# Altium schematic sheet Power.SchDoc
size 431 x 279 mm; DocumentNumber: 3; SheetNumber: 13; SheetTotal: 13
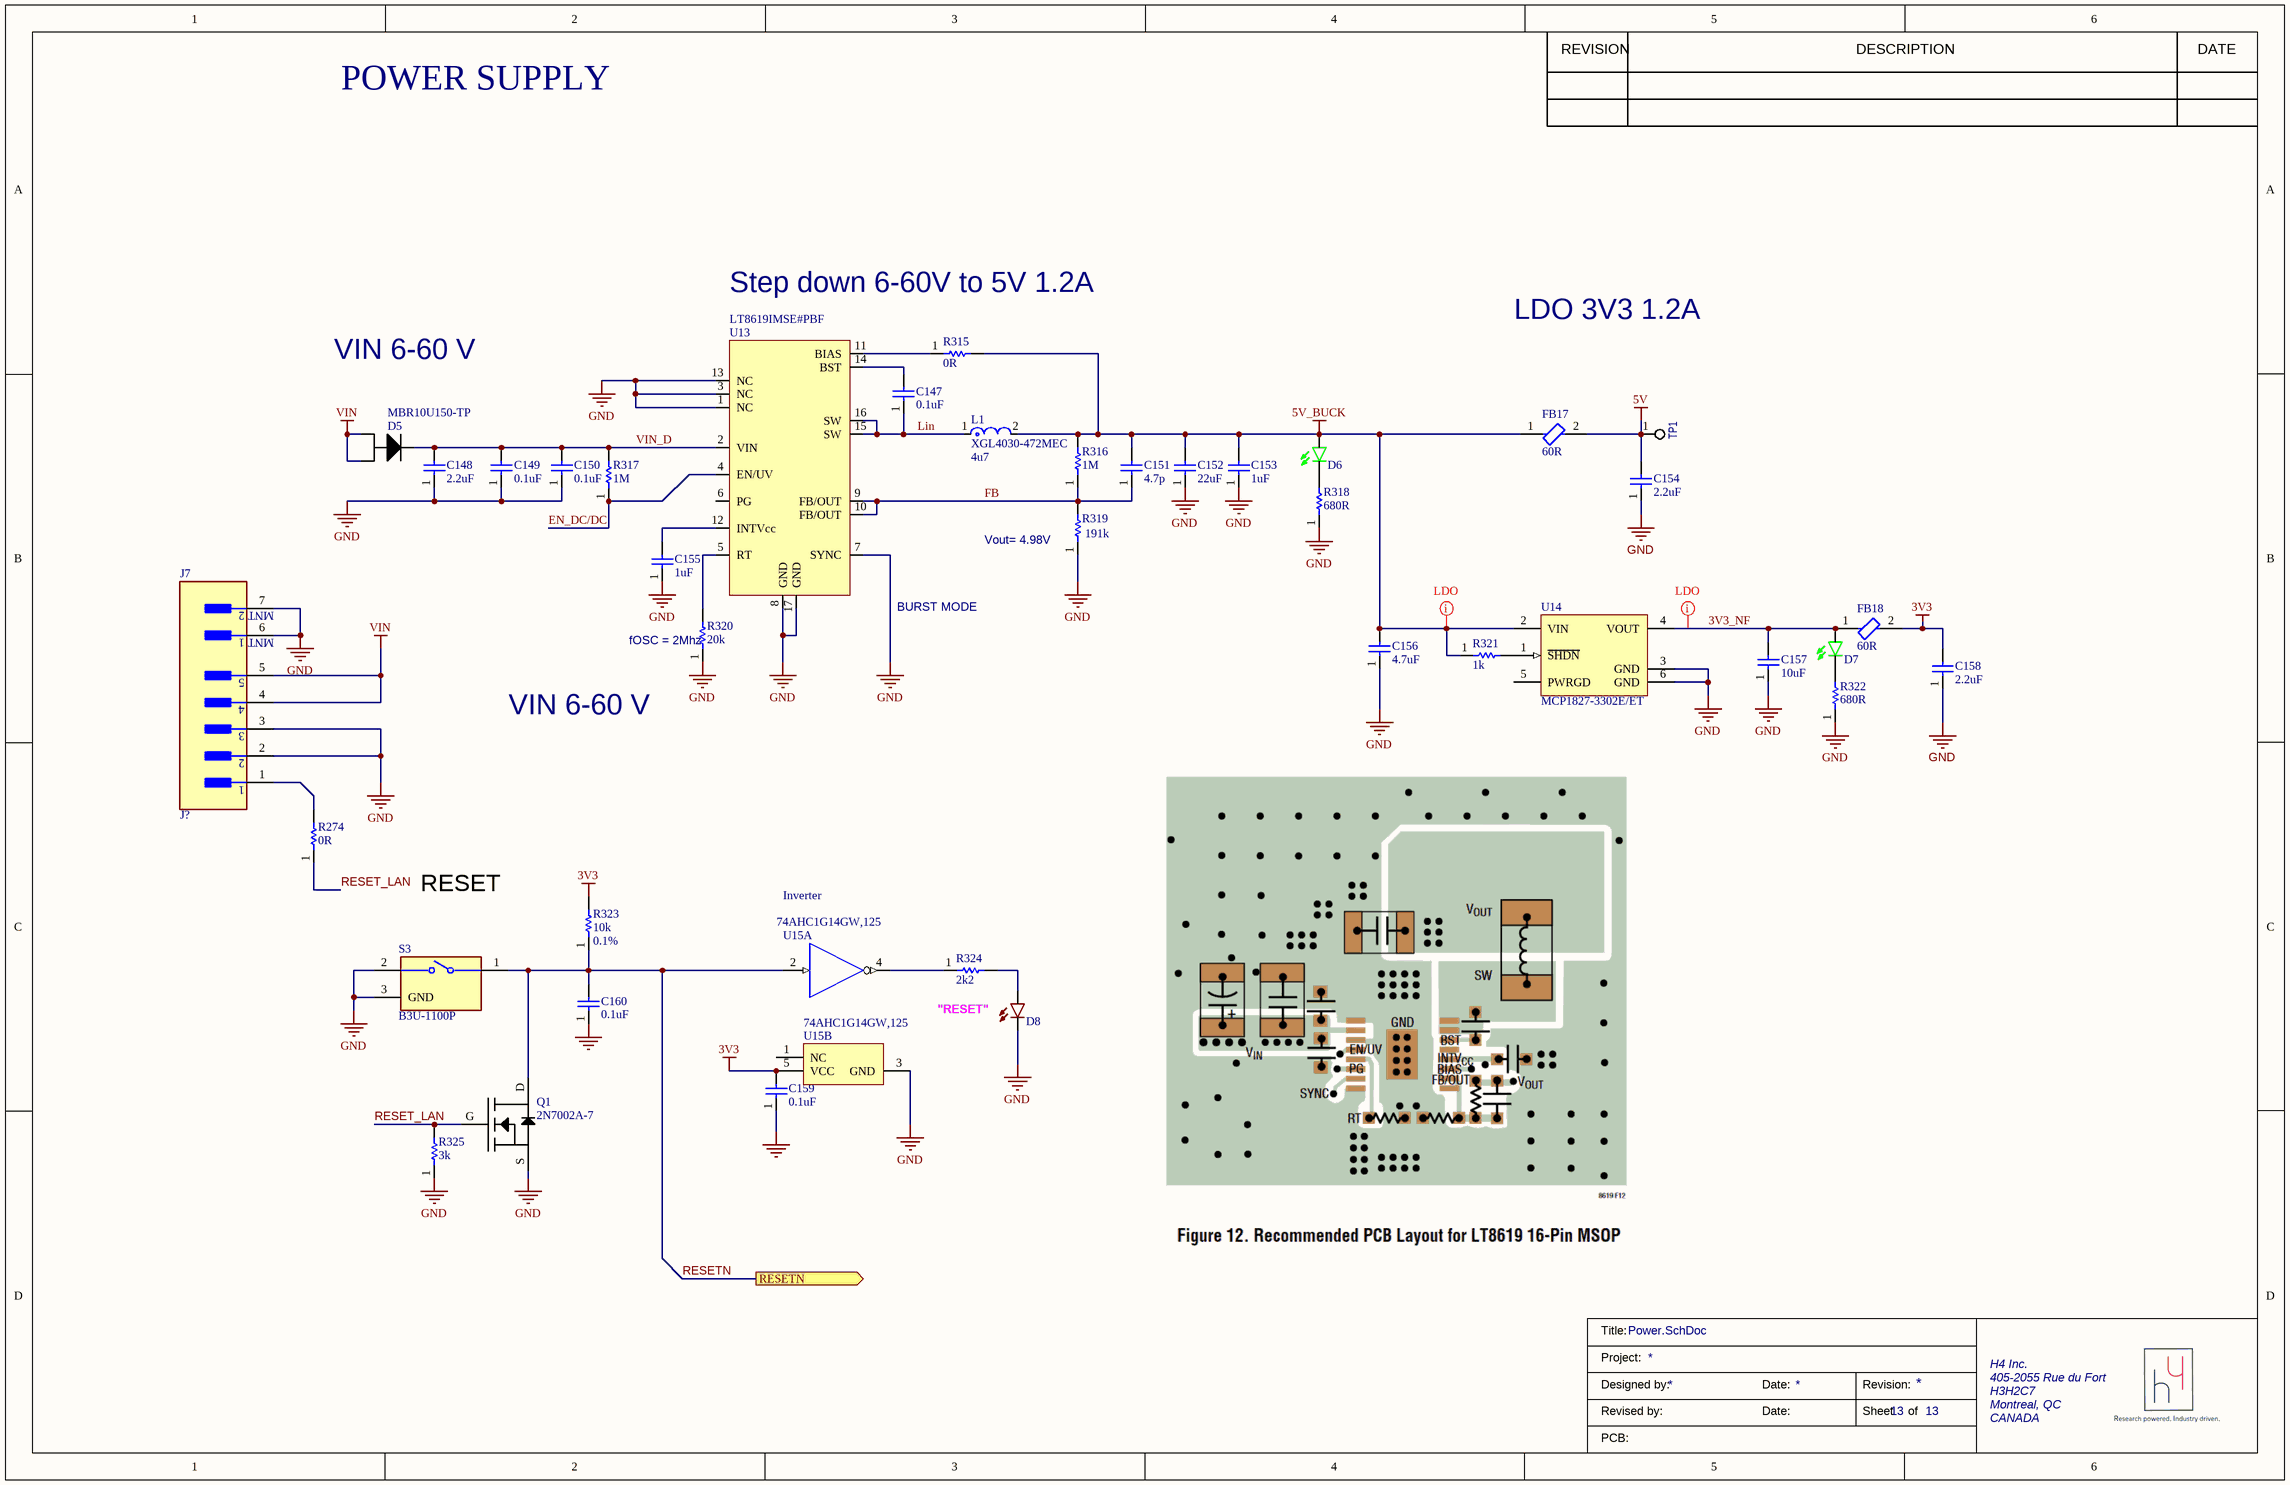
[diagram p0: Power.SchDoc]

## Parts
C147  value 0.1uF  [CAPC1608X09N(0603)]  (hidden comment: CL10B104KC8NNNC)
C148  value 2.2uF  [CAPC3216X16N(1206)]  (hidden comment: C3216X7S2A225K160AB)
C149  value 0.1uF  [CAPC1608X09N(0603)]  (hidden comment: CL10B104KC8NNNC)
C150  value 0.1uF  [CAPC1608X09N(0603)]  (hidden comment: CL10B104KC8NNNC)
C151  value 4.7p  [0402_C]  (hidden comment: CGA2B2C0G1H4R7C050BA)
C152  value 22uF  [CAPC1608X09N(0603)]  (hidden comment: C1608X5R1A226M080AC)
C153  value 1uF  [CAPC1608X09N(0603)]  (hidden comment: C0603C105K3PACTU)
C154  value 2.2uF  [CAPC1608X09N(0603)]  (hidden comment: GRM188R61A225KE34D)
C155  value 1uF  [CAPC1608X09N(0603)]  (hidden comment: C0603C105K3PACTU)
C156  value 4.7uF  [CAPC1608X09N(0603)]  (hidden comment: CL10A475KP8NNNC)
C157  value 10uF  [CAPC3216X16N(1206)]  (hidden comment: GRM319R6YA106KA12D)
C158  value 2.2uF  [CAPC1608X09N(0603)]  (hidden comment: GRM188R61A225KE34D)
C159  value 0.1uF  [CAPC1608X09N(0603)]  (hidden comment: C0603C104K5RACTU)
C160  value 0.1uF  [CAPC1608X09N(0603)]  (hidden comment: C0603C104K5RACTU)
D5  MBR10U150-TP  [TO-277]
D6  LTST-C193KGKT-5A  [LEDC1608X07N(0603)]  (value not drawn)
D7  LTST-C193KGKT-5A  [LEDC1608X07N(0603)]  (value not drawn)
D8  LTST-C193KRKT-5A  [LEDC1608X07N(0603)]  (value not drawn)
FB17  Impedance: 60R  [FP-BKP2125-IPC_C]  (hidden comment: BKP2125HS600-T)
FB18  Impedance: 60R  [FP-BKP2125-IPC_C]  (hidden comment: BKP2125HS600-T)
J7  J?  [FP-BM05B-GHS-TBT_LF_SN-MFG]
L1  XGL4030-472MEC  value 4u7  [FP-XGL4030-472MEC-MFG]
Q1  2N7002A-7  [SOT95P230X110-3N]
R274  value 0R  [RESC1608X09N(0603)]
R315  value 0R  [RESC1608X09N(0603)]  (hidden comment: RC0603JR-070RL)
R316  value 1M  [RESC1608X09N(0603)]  (hidden comment: RC0603FR-071ML)
R317  value 1M  [RESC1608X09N(0603)]  (hidden comment: RC0603FR-071ML)
R318  value 680R  [RESC1608X09N(0603)]  (hidden comment: RC0603FR-07680RL)
R319  value 191k  [0402]  (hidden comment: ERJ-2RKF1913X)
R320  value 20k  [0402]  (hidden comment: ERJ-2RKF2002X)
R321  value 1k  [RESC1608X09N(0603)]  (hidden comment: CRCW06031K00FKEA)
R322  value 680R  [RESC1608X09N(0603)]  (hidden comment: RC0603FR-07680RL)
R323  value 10k  Tolerance: 0.1%  [0603]  (hidden comment: RT0603BRB0710KL)
R324  value 2k2  [RESC1608X09N(0603)]  (hidden comment: RC0603FR-072K2L)
R325  value 3k  [RESC1608X09N(0603)]  (hidden comment: RC0603FR-073KL)
S3  B3U-1100P  [FP-B3U-1100P-MFSWITCH_G]
TP1  TP_SMD  [Pad_1mm]  (value not drawn)  (no BOM)
U13  LT8619IMSE#PBF  [SOP50P490X110-17N]
U14  MCP1827-3302E/ET  [5-DDPAK _Model2]
U15  74AHC1G14GW,125  [NXP-SOT353-1_L_TSSOP5]  (parts A,B of 2)

## Ports
RESETN (out, see Overview[2B], ECAT SWITCH[1B], LAN9254_A_P1[2B], LAN9254_B_P1[2B], LAN9254_C_P1[2B], LAN9254_D_P1[2B])

## Nets
3V3: C158.2 C159.2 FB18.2 R323.2 U15.5(VCC)
5V: C154.2 FB17.2 TP1.1(IN)
5V_BUCK: C151.2 C152.2 C153.2 C156.2 D6.A FB17.1 L1.2 R315.2 R316.2 R321.1 U14.2(VIN)
GND: C148.1 C149.1 C150.1 C152.1 C153.1 C154.1 C155.1 C156.1 C157.1 C158.1 C159.1 C160.1 D8.C J7.2 J7.3 J7.6(MNT_1) J7.7(MNT_2) Q1.S R318.1 R319.1 R320.1 R322.1 R325.1 S3.2 S3.3(GND) U13.1(NC) U13.3(NC) U13.7(SYNC) U13.8(GND) U13.13(NC) U13.17(GND) U14.3(GND) U14.6(GND) U15.3(GND)
VIN: D5.1 D5.2 J7.4 J7.5
3V3_NF: C157.2 D7.A FB18.1 U14.4(VOUT)
EN_DC/DC: R317.1 U13.4(EN/UV)
FB: C151.1 R316.1 R319.2 U13.9(FB/OUT) U13.10(FB/OUT)
Lin: C147.1 L1.1 U13.15(SW) U13.16(SW)
RESET_LAN: Q1.G R274.1 R325.2
RESETN: C160.2 Q1.D R323.1 S3.1 U15.2(A) ; port RESETN
VIN_D: C148.2 C149.2 C150.2 D5.3 R317.2 U13.2(VIN)
NetC147_2: C147.2 U13.14(BST)
NetC155_2: C155.2 U13.12(INTVcc)
NetD6_C: D6.C R318.2
NetD7_C: D7.C R322.2
NetD8_A: D8.A R324.2
NetJ7_1: J7.1 R274.2
NetR315_1: R315.1 U13.11(BIAS)
NetR320_2: R320.2 U13.5(RT)
NetR321_2: R321.2 U14.1(~{SHDN})
NetR324_1: R324.1 U15.4(~{Y})

Not connected (* = marked no-connect by the designer): U13 6(PG); U14 5(PWRGD); U15 1(NC)

## Layout directives
net class LDO: 3V3_NF, 5V_BUCK

## Notes on the sheet
- POWER SUPPLY
- Step down 6-60V to 5V 1.2A
- VIN 6-60 V
- LDO 3V3 1.2A
- (near R319) Vout= 4.98V
- (near U13) BURST MODE
- (near R320) fOSC = 2Mhz
- RESET
- Inverter
- "RESET"
- REVISION
- DESCRIPTION
- DATE
- Title:
- Project:
- H4 Inc.
- Designed by:
- Revised by:
- Date:
- Revision:
- Sheet
- of
- 405-2055 Rue du Fort
- H3H2C7
- Montreal, QC
- CANADA
- PCB:

## Library data of the parts
C147 C149 C150 = 0.1uF_100V_0603_CAP: CAP CER 0.1UF 100V X7R 0603; Tolerance: 10%; MPN: CL10B104KC8NNNC; Volage Rating: 100V; Temp Coefficent: X7R; Mounting Type: Surface Mount; Case/Package: 0603; Supplier 1: Digi-Key; Supplier Part Number 1: 1276-6807-1-ND
C148 = 2.2uF_100V_1206_Cap: CAP CER 2.2UF 100V X7S 1206; Tolerance: 10%; MPN: C3216X7S2A225K160AB; Voltage Rating: 100V; Temp Coefficient: X7S; Package/Case: 1206; Mounting Type: Surface Mount; Supplier 1: Digi-Key; Supplier Part Number 1: 445-5207-1-ND
C151 = 4p7_0402_50V_C0G_  CGA2B2C0G1H4R7C050BA: Multilayer Ceramic Capacitor, CGA Series, 4.7 pF, 0.25pF, C0G / NP0, 50 V, 0402 [1005 Metric] ;RoHS Compliant: Yes; Manufacturer: TDK; Capacitance: 4.7pF; Voltage Rating: 50V; Supplier 1: Digi-Key; Manufacturer Part Number: CGA2B2C0G1H4R7C050BA; RoHS: Yes; Category: Ceramic Capacitors; Stock 1: 26180; Pricing 1: 1=0.10000, 10=0.06000, 50=0.03300, 100=0.02700, 500=0.01924, 1000=0.01512, 2500=0.01375, 5000=0.01265 (USD); Mount: Surface Mount; Case/Package: 0402; Case Code (Metric): 1005; Case Code (Imperial): 0402; Weight: 2.3E-05oz; Min Operating Temperature: -55°C; Max Operating Temperature: 125°C; Packaging: Cut Tape; Voltage Rating (DC): 50V; Dielectric: C0G; Termination: Standard; Series: CGA; Package Quantity: 10000; Resistor Type: Ceramic; Length: 1mm; Width: 0.5mm; Height: 0.5mm; Thickness: 0.022inch; Depth: 0.5mm; Ratings: AEC-Q200; RoHS Compliant: Yes; REACH SVHC: No SVHC; ComponentLink1URL: https://datasheet.ciiva.com/24217/cga2b2c0g1h4r7c050ba-265785-24217343.pdf?src-supplier=Mouser; ComponentLink1Description: https://datasheet.ciiva.com/24217/cga2b2c0g1h4r7c050ba-265785-24217343.pdf?src-supplier=Mouser; Supplier Part Number 1: 445-5577-1-ND
C152 = 22uF_10V_0603_CAP: CAP CER 22UF 10V X5R 0603; Tolerance: 20%; MPN: C1608X5R1A226M080AC; Voltage: 10V; Temp Cofficient: X5R; Package: 0603; Supplier 1: Digikey; Supplier Part Number 1: 445-9077-6-ND
C153 C155 = 1uF_25VDC_0603_Cap: MLCC - SMD/SMT 25volts 1uF X5R 10%; Voltage: 25VDC; Drawn By: TC; MPN: C0603C105K3PACTU; Tolerance: 10%; Supplier 1: Mouser; Supplier Part Number 1: 80-C0603C105K3PAC
C154 C158 = 2.2uF_10V_0603_CAP: CAP CER 2.2UF 10V X5R 0603; Tolerance: 10%; MPN: GRM188R61A225KE34D; Voltage Rating: 10V; Temp Cofficient: X5R; Size: 0603; Supplier 1: Digikey; Supplier Part Number 1: 490-1545-1-ND
C156 = 4.7uF_10V_0603_CAP: CAP CER 4.7UF 10V X5R 0603; MPN: CL10A475KP8NNNC; Voltage Rating: 10V; Temp Cofficient: X5R; Size/Package: 0603; Supplier 1: Digi-Key; Supplier Part Number 1: 1276-1044-1-ND
C157 = 10uF_35VDC_1206_Cap: MLCC - SMD/SMT 1206 10uF 35volts; Voltage: 35VDC; Tolerance: 10%; Drawn By: TC; MPN: GRM319R6YA106KA12D; Supplier 1: Digi-Key; Supplier Part Number 1: 490-9964-6-ND; Check By: *
C159 C160 = 0.1uF_50V_0603_MLCC: CAP CER 0.1UF 50V X7R 0603; Voltage: 50VDC; Tolerance: 10%; MPN: C0603C104K5RACTU; Package: 0603; Dialectric: X7R; Supplier 1: Digi-Key; Supplier Part Number 1: 399-5089-1-ND
D5 = MBR10U150-TP_SCHOTTKY_150V_10A: Diode Schottky 150V 10A TO277; Manufacturer: MCC; Supplier 1: DigiKey; Manufacturer Part Number: MBR10U150-TP; Stock 1: 3846; Pricing 1: 1=0.74000, 10=0.65300, 100=0.50090, 500=0.39600, 1000=0.31680, 2000=0.28710 (USD); Supplier Part Number 1: 353-MBR10U150-TPCT-ND
D6 D7 = GREEN_LED_0603: LED GREEN CLEAR CHIP SMD; If: 5mA; Vf: 2V; MPN: LTST-C193KGKT-5A; Drawn By: TC; Supplier 1: Digi-Key; Color: Green; Supplier Part Number 1: 160-1828-1-ND
D8 = RED_LED_0603: LED RED CLEAR CHIP SMD; If: 5mA; Vf: 2V; MPN: LTST-C193KRKT-5A; Drawn By: TC; Supplier 1: Digi-Key; Color: Red; Supplier Part Number 1: 160-1830-1-ND
FB17 FB18 = 60R_100Mhz_0805_3A: TAIYO YUDEN - BKP2125HS600-T - Ferrite Bead, 0805 [2012 Metric], 60 ohm, 3 A, BKP Series, 0.025 ohm, ± 25%; Max DC Current: 3A; Number of Lines: 1; DC Resistance (DCR): 25mR; Test Frequency: 100MHz; Shielding: Unshielded; Packaging: Tape and Reel; Case Code (Imperial): 0805; Series: BK; Package Quantity: 1; Tolerance: 25%; Lead Free: Lead Free; Number of Pins: 2; Max Current Rating: 3A; Length: 2.3mm; Case/Package: 0805; Max Operating Temperature: 85°C; Min Operating Temperature: -55°C; Core Material: Ferrite; Case Code (Metric): 2125; Depth: 1.45mm; Resistance: 25mR; Halogen Free: Halogen Free; Termination: SMD/SMT; Width: 0.049inch; RoHS Compliant: Yes; Mount: Surface Mount; Height: 1.05mm; Supplier 1: Digi-Key; Manufacturer: Taiyo Yuden; Manufacturer Part Number: BKP2125HS600-T; RoHS: Yes; Category: Inductors; Stock 1: 308405; Pricing 1: 1=0,12000, 10=0,09400, 25=0,08480, 50=0,06200, 100=0,05360, 250=0,04232, 500=0,03574, 1000=0,03010 (USD); REACH SVHC: Unknown; ComponentLink1URL: https://datasheet.ciiva.com/6213/bkp2125hs600-t-ss-6213090.pdf?src-supplier=Digi-Key; ComponentLink1Description: https://datasheet.ciiva.com/6213/bkp2125hs600-t-ss-6213090.pdf?src-supplier=Digi-Key; ComponentLink2URL: https://datasheet.ciiva.com/30063/884bkp2125hs600-t-30063956.pdf?src-supplier=Onlinecomponents.com; ComponentLink2Description: https://datasheet.ciiva.com/30063/884bkp2125hs600-t-30063956.pdf?src-supplier=Onlinecomponents.com; ComponentLink3URL: https://datasheet.ciiva.com/6213/mlci08-e-6213094.pdf?src-supplier=Digi-Key; ComponentLink3Description: https://datasheet.ciiva.com/6213/mlci08-e-6213094.pdf?src-supplier=Digi-Key; ComponentLink4URL: https://datasheet.ciiva.com/6213/mlci08-e-6213097.pdf?src-supplier=Digi-Key; ComponentLink4Description: https://datasheet.ciiva.com/6213/mlci08-e-6213097.pdf?src-supplier=Digi-Key; Supplier Part Number 1: 587-1932-1-ND
J7 = BM05B-GHS-TBT_5POS_JST_GH: GH Series 5 Circuits 1.25 mm Pitch Disconnectable Top Entry Shrouned Header; Manufacturer: JST; Manufacturer Part Number: BM05B-GHS-TBT(LF)(SN)(N); RoHS: Yes; Category: Headers and Wire Housings; ComponentLink1URL: http://www.jst-mfg.com/product/pdf/eng/eGH.pdf?src-supplier=Digi-Key; ComponentLink1Description: http://www.jst-mfg.com/product/pdf/eng/eGH.pdf?src-supplier=Digi-Key; Supplier: Digi-Key; Supplier Part Number: 455-1581-1-ND; Pricing: 1=0.46, 10=0.397, 100=0.3271, 500=0.2844, 1000=0.23463 (USD)
L1 = XGL4030-472MEC_4u7_2A1_IND: Inductor Power Shielded Wirewound 4.7uH 20% 1MHz Composite 6.6A 31.5mOhm DCR Automotive T/R; DCRMax: 31.5; Isat10%: 2.1; MPN: XGL4030-472
Q1 = 2N7002_N-MOS: MOSFET N-CH 60V 0.18A SOT23; FET Type: N-Channel; Id: 180mA; Max Rds ON: 10V; Vgs(th): 2V@250uA; Vgs(Max): +/-20V; MPN: 2N7002A-7; Vdss: 60V; Package: SOT23
R274 = 0R_1/10W_0603_RES: RES SMD 0 OHM JUMPER 1/10W 0603; MPN: RC0603JR-070RL; Tolerance: Jumper; Power: 1/10W; Package/Case: 0603; Supplier 1: Digi-Key; Supplier Part Number 1: 311-0.0GRDKR-ND
R315 = 0R_1/10W_0603_RES: RES SMD 0 OHM JUMPER 1/10W 0603; MPN: RC0603JR-070RL; Tolerance: Jumper; Power: 1/10W; Package/Case: 0603; Supplier 1: Digi-Key; Supplier Part Number 1: 311-0.0GRDKR-ND
R316 R317 = 1M_1/10W_RES_0603: RES SMD 1M OHM 1% 1/10W 0603; MPN: RC0603FR-071ML; Tolerance: 1%; Power: 1/10W; Supplier 1: Digi-Key; Supplier Part Number 1: 311-1.00MHRCT-ND; Size: 0603
R318 R322 = 680R_1/10W_0603_RES: RES SMD 680 OHM 1% 1/10W 0603; MPN: RC0603FR-07680RL; Tolerance: 1%; Power: 1/10W; Composition: Thick Film; Package: 0603; Supplier 1: Digi-Key; Supplier Part Number 1: 311-680HRCT-ND
R319 = 191k_0402_1%_ERJ-2RKF1913X: Thick Film Resistors - SMD 0402 191Kohms 1% Tol; Manufacturer: Panasonic; Voltage Rating: 50V; Resistance: 191kR; Power Rating: 100mW; Temperature Coefficient: 100ppm/°C; Tolerance: 1%; Supplier 1: Digi-Key; Manufacturer Part Number: ERJ-2RKF1913X; RoHS: Yes; Category: Chip SMD Resistors; Stock 1: 1156; Pricing 1: 1=0.10000, 10=0.02500, 100=0.01020, 1000=0.00457, 2500=0.00397, 5000=0.00328 (USD); Mount: Surface Mount; Case/Package: 0402; Case Code (Metric): 1005; Case Code (Imperial): 0402; Contact Plating: Tin; Min Operating Temperature: -55°C; Max Operating Temperature: 155°C; Packaging: Tape and Reel; Package Quantity: 1; Resistor Type: Thick Film; Number of Terminations: 2; Termination: SMD/SMT; Max Power Dissipation: 100mW; Voltage Rating (DC): 50V; Features: Automotive AEC-Q200; Series: ERJ; Resistance Tolerance: 1%; Construction: Rectangular; Length: 1mm; Width: 0.02inch; Height: 0.016inch; Depth: 0.5mm; Radiation Hardening: No; REACH SVHC: No SVHC; Military Standard: Not; Lead Free: Lead Free; RoHS Compliant: Yes; ComponentLink1URL: https://datasheet.ciiva.com/24069/aoa0000ce2-24069791.pdf?src-supplier=Mouser; ComponentLink1Description: https://datasheet.ciiva.com/24069/aoa0000ce2-24069791.pdf?src-supplier=Mouser; ComponentLink2URL: https://datasheet.ciiva.com/16758/70260748-16758232.pdf?src-supplier=Allied+Electronics; ComponentLink2Description: https://datasheet.ciiva.com/16758/70260748-16758232.pdf?src-supplier=Allied+Electronics; ComponentLink3URL: https://datasheet.ciiva.com/7853/1678782-7853690.pdf?src-supplier=Element14; ComponentLink3Description: https://datasheet.ciiva.com/7853/1678782-7853690.pdf?src-supplier=Element14; ComponentLink4URL: https://datasheet.ciiva.com/22673/1678782-22673751.pdf?src-supplier=Element14; ComponentLink4Description: https://datasheet.ciiva.com/22673/1678782-22673751.pdf?src-supplier=Element14; ComponentLink5URL: https://datasheet.ciiva.com/16522/aoa0000ce2-16522489.pdf?src-supplier=Avnet+Asia; ComponentLink5Description: https://datasheet.ciiva.com/16522/aoa0000ce2-16522489.pdf?src-supplier=Avnet+Asia; ComponentLink6URL: https://datasheet.ciiva.com/30055/aoa0000ce2-30055273.pdf?src-supplier=Onlinecomponents.com; ComponentLink6Description: https://datasheet.ciiva.com/30055/aoa0000ce2-30055273.pdf?src-supplier=Onlinecomponents.com; Supplier Part Number 1: P191KLCT-ND
R320 = 20K_0402_1%_ERJ-2RKF2002X_RES: RES SMD 20K OHM 1% 1/10W 0402; Manufacturer: Panasonic; Resistance: 20kR; Power Rating: 100mW; Voltage Rating: 50V; Temperature Coefficient: 100ppm/°C; Supplier 1: Digi-Key; Manufacturer Part Number: ERJ-2RKF2002X; RoHS: Yes; Category: Chip SMD Resistors; Stock 1: 220592; Pricing 1: 1=0.10000, 10=0.02500, 100=0.01020, 1000=0.00457, 2500=0.00397, 5000=0.00328 (USD); Mount: Surface Mount; Case/Package: 0402; Case Code (Metric): 1005; Case Code (Imperial): 0402; Weight: 2.8E-05oz; Contact Plating: Tin; Size Code: 0402; Min Operating Temperature: -55°C; Max Operating Temperature: 155°C; Tolerance: 1%; Packaging: Cut Tape; Package Quantity: 1; Resistor Type: Thick Film; Number of Terminations: 2; Termination: SMD/SMT; Max Power Dissipation: 100mW; Voltage Rating (DC): 50V; Features: Automotive AEC-Q200; Series: ERJ; Technology: THICK FILM; Resistance Tolerance: 1%; Construction: Rectangular; Length: 1mm; Width: 0.02inch; Height: 0.35mm; Depth: 0.5mm; Radiation Hardening: No; REACH SVHC: No SVHC; Military Standard: Not; Lead Free: Lead Free; RoHS Compliant: Yes; ComponentLink1URL: https://datasheet.ciiva.com/11821/0900766b80f80784-11821220.pdf?src-supplier=RSComponents; ComponentLink1Description: https://datasheet.ciiva.com/11821/0900766b80f80784-11821220.pdf?src-supplier=RSComponents; ComponentLink2URL: https://datasheet.ciiva.com/6138/426256-6138761.pdf?src-supplier=Farnell; ComponentLink2Description: https://datasheet.ciiva.com/6138/426256-6138761.pdf?src-supplier=Farnell; ComponentLink3URL: https://datasheet.ciiva.com/48531/aoa0000ce2-48531063.pdf?src-supplier=Avnet; ComponentLink3Description: https://datasheet.ciiva.com/48531/aoa0000ce2-48531063.pdf?src-supplier=Avnet; ComponentLink4URL: https://datasheet.ciiva.com/24159/aoa0000ce2-24159274.pdf?src-supplier=Mouser; ComponentLink4Description: https://datasheet.ciiva.com/24159/aoa0000ce2-24159274.pdf?src-supplier=Mouser; ComponentLink5URL: https://datasheet.ciiva.com/16514/aoa0000ce2-16514269.pdf?src-supplier=Avnet+Asia; ComponentLink5Description: https://datasheet.ciiva.com/16514/aoa0000ce2-16514269.pdf?src-supplier=Avnet+Asia; ComponentLink6URL: https://datasheet.ciiva.com/16508/aoa0000ce2-16508524.pdf?src-supplier=Future+Electronics; ComponentLink6Description: https://datasheet.ciiva.com/16508/aoa0000ce2-16508524.pdf?src-supplier=Future+Electronics; ComponentLink7URL: https://datasheet.ciiva.com/30049/aoa0000ce2-30049982.pdf?src-supplier=Onlinecomponents.com; ComponentLink7Description: https://datasheet.ciiva.com/30049/aoa0000ce2-30049982.pdf?src-supplier=Onlinecomponents.com; ComponentLink8URL: https://datasheet.ciiva.com/28688/1678782-28688600.pdf?src-supplier=Element14; ComponentLink8Description: https://datasheet.ciiva.com/28688/1678782-28688600.pdf?src-supplier=Element14; ComponentLink9URL: https://datasheet.ciiva.com/16782/70260748-16782455.pdf?src-supplier=Allied+Electronics; ComponentLink9Description: https://datasheet.ciiva.com/16782/70260748-16782455.pdf?src-supplier=Allied+Electronics; ComponentLink10URL: https://datasheet.ciiva.com/16762/70260748-16762885.pdf?src-supplier=Allied+Electronics; ComponentLink10Description: https://datasheet.ciiva.com/16762/70260748-16762885.pdf?src-supplier=Allied+Electronics; ComponentLink11URL: https://datasheet.ciiva.com/46377/426256-46377368.pdf?src-supplier=Element14; ComponentLink11Description: https://datasheet.ciiva.com/46377/426256-46377368.pdf?src-supplier=Element14; Supplier Part Number 1: P20.0KLCT-ND
R321 = 1k_1/10W_RES_0603: MD 1/10watt 1.0Kohms 1%; Wattage: 0.1W; MPN: CRCW06031K00FKEA; Toleracne: 1%; Drawn By: TC; Supplier 1: Digi-Key; Size: 0603; Supplier Part Number 1: 541-1.00KHCT-ND
R323 = 10k_1/10W_0.1%_10ppm_0603_RES: RES SMD 10K OHM 0.1% 1/10W 0603; Manufacturer: Yageo; Resistance: 10kR; Power Rating: 100mW; Voltage Rating: 75V; Temperature Coefficient: 10ppm/°C; Supplier 1: Digi-Key; Manufacturer Part Number: RT0603BRB0710KL; RoHS: Yes; Category: Chip SMD Resistors; Pricing 1: 1=0.60000, 10=0.44100, 100=0.25710, 1000=0.14419, 2500=0.13920 (USD); Case/Package: 0603; Case Code (Imperial): 0603; Case Code (Metric): 1608; Weight: 7.1E-05oz; Min Operating Temperature: -55°C; Max Operating Temperature: 125°C; Packaging: Tape and Reel; Resistor Type: Thin Film; Number of Terminations: 2; Termination: SMD/SMT; Max Power Dissipation: 100mW; Features: Moisture Resistant; Series: RT; Construction: Rectangular; Length: 1.6mm; Width: 0.031inch; Height: 0.022inch; Depth: 0.8mm; Military Standard: Not; RoHS Compliant: Yes; ComponentLink1URL: https://datasheet.ciiva.com/12837/pyu-rt-1-to-0-05-rohs-l-4-12837352.pdf?src-supplier=Mouser; ComponentLink1Description: https://datasheet.ciiva.com/12837/pyu-rt-1-to-0-05-rohs-l-4-12837352.pdf?src-supplier=Mouser; Supplier Part Number 1: YAG4438CT-ND
R324 = 2k2_1/10W_0603_RES: RES SMD 2.2K OHM 1% 1/10W 0603; Power(Watts): 1/10; MPN: RC0603FR-072K2L; Tolerance: 1%; Composition: Thick Film; Package/case: 0603; Supplier 1: Digi-Key; Supplier Part Number 1: 311-2.20KHRCT-ND
R325 = 3k_1/10W_0603_RES: RES SMD 3K OHM 1% 1/10W 0603; Wattage: .1; MPN: RC0603FR-073KL; Tolerance: 1%; Drawn By: TC; Checked By: *; Supplier 1: Digi-Key; Supplier Part Number 1: 311-3.00KHRCT-ND
S3 = SWITCH_SPST_NO_B3U-1100P: Switch Tactile N.O. SPST Round Button Gull Wing 0.05A 12VDC 1.5N SMD Embossed T/R; Manufacturer: Omron; Mechanical Life: 200000Cycles; Voltage Rating (DC): 12V; Contact Resistance: 100mR; Current Rating: 50mA; Illumination Type: Non-Illuminated,Illuminated; Switch Travel: 0.15mm; Switch Function: Off-Mom; Actuator Type: Standard; Actuator Length: 0.4mm; Ratings: Dust Proof; Supplier 1: Digi-Key; Manufacturer Part Number: B3U-1100P; RoHS: Yes; Category: Tactile Switches; Pricing 1: 1=0.96000, 10=0.92700, 25=0.86640, 100=0.75220, 250=0.68448, 500=0.63456, 1000=0.62388 (USD); Mount: Surface Mount; Weight: 0.022g; Contact Plating: Silver; Min Operating Temperature: -25°C; Max Operating Temperature: 70°C; Operating Force: 1.5N; Throw Configuration: SPST; Packaging: Tape and Reel; Max Voltage Rating (DC): 12V; Package Quantity: 1; Electrical Life: 200000Cycles; Orientation: Straight; Series: B3U; Termination: SMD/SMT; Max Current Rating: 50mA; Contact Current Rating: 50mA; Length: 3.15mm; Depth: 4mm; RoHS Compliant: Yes; REACH SVHC: Unknown; Lead Free: Lead Free; ComponentLink1URL: https://datasheet.ciiva.com/1634/60838-1634404.pdf?src-supplier=Farnell; ComponentLink1Description: https://datasheet.ciiva.com/1634/60838-1634404.pdf?src-supplier=Farnell; ComponentLink2URL: https://datasheet.ciiva.com/2901/b3u-1110-2901097.pdf?src-supplier=Digi-Key; ComponentLink2Description: https://datasheet.ciiva.com/2901/b3u-1110-2901097.pdf?src-supplier=Digi-Key; ComponentLink3URL: https://datasheet.ciiva.com/2901/b3u-1110-2901098.pdf?src-supplier=Digi-Key; ComponentLink3Description: https://datasheet.ciiva.com/2901/b3u-1110-2901098.pdf?src-supplier=Digi-Key; ComponentLink4URL: https://datasheet.ciiva.com/2901/b3u-1110-2901099.pdf?src-supplier=Digi-Key; ComponentLink4Description: https://datasheet.ciiva.com/2901/b3u-1110-2901099.pdf?src-supplier=Digi-Key; ComponentLink5URL: https://datasheet.ciiva.com/30197/en-b3u-30197271.pdf?src-supplier=Onlinecomponents.com; ComponentLink5Description: https://datasheet.ciiva.com/30197/en-b3u-30197271.pdf?src-supplier=Onlinecomponents.com; ComponentLink6URL: https://datasheet.ciiva.com/16155/en-b3u-16155023.pdf?src-supplier=Onlinecomponents.com; ComponentLink6Description: https://datasheet.ciiva.com/16155/en-b3u-16155023.pdf?src-supplier=Onlinecomponents.com; ComponentLink7URL: https://datasheet.ciiva.com/1532/60838-1532684.pdf?src-supplier=Element14; ComponentLink7Description: https://datasheet.ciiva.com/1532/60838-1532684.pdf?src-supplier=Element14; ComponentLink8URL: https://datasheet.ciiva.com/22696/60838-22696216.pdf?src-supplier=Element14; ComponentLink8Description: https://datasheet.ciiva.com/22696/60838-22696216.pdf?src-supplier=Element14; ComponentLink9URL: https://datasheet.ciiva.com/14142/b3u-eng-datasheet-14142541.pdf?src-supplier=Distrelec; ComponentLink9Description: https://datasheet.ciiva.com/14142/b3u-eng-datasheet-14142541.pdf?src-supplier=Distrelec; Supplier Part Number 1: SW1021CT-ND
TP1 = TP_SMD_1MM: Test point SMD
U13 = LT8619IMSE#PBF_BUCK_60V_1A2: LT8619 - 60V, 1.2A Synchronous Monolithic Buck Regulator with 6µA Quiescent Current; Manufacturer: Analog Devices / Linear Technology; Supplier 1: Digi-Key; Manufacturer Part Number: LT8619IMSE#PBF; RoHS: Yes; Pricing 1: 1=6.38000, 10=5.76600, 25=5.49760, 100=4.77360, 250=4.55904, 500=4.17450 (USD); Number of Pins: 16; RoHS Compliant: Yes; Supplier Part Number 1: 505-LT8619IMSE#PBF-ND
U14 = 3V3_LDO_1A5_MCP1827-3302E/ET: MCP1827-3302E/ET; LDOVoltage Regulator; 1.5A; 3.3V +/-2%; 2.3 to 6Vin; 5-Pin D2PAK; Manufacturer: Microchip; Dropout Voltage: 330mV; Number of Outputs: 1; Min Input Voltage: 2.3V; Max Input Voltage: 6V; Input Bias Current: 120uA; Polarity: Positive; Quiescent Current: 220uA; Accuracy: 2%; Output Type: Fixed; Supplier 1: Digi-Key; Manufacturer Part Number: MCP1827-3302E/ET; RoHS: Yes; Category: Voltage Regulators - Linear; Stock 1: 263; Pricing 1: 1=1.88000, 25=1.71000 (USD); Mount: Surface Mount; Case/Package: TO-263; Number of Pins: 5; Min Operating Temperature: -40°C; Max Operating Temperature: 125°C; Output Current: 1.5A; Output Voltage: 3.3V; Packaging: Rail/Tube; Max Output Current: 1.5A; Package Quantity: 50; Min Output Voltage: 3.3V; Output Voltage Accuracy: 2%; Length: 10.67mm; Width: 0.447inch; Height: 0.19inch; Radiation Hardening: No; REACH SVHC: No SVHC; Lead Free: Lead Free; RoHS Compliant: Yes; ComponentLink1URL: https://datasheet.ciiva.com/41458/001085985-da-01-en-ic-reg-ldo-mcp1827-3302e-et-ddpak-5-mcp-41458756.pdf?src-supplier=Conrad; ComponentLink1Description: https://datasheet.ciiva.com/41458/001085985-da-01-en-ic-reg-ldo-mcp1827-3302e-et-ddpak-5-mcp-41458756.pdf?src-supplier=Conrad; ComponentLink2URL: https://datasheet.ciiva.com/8041/1789203-8041529.pdf?src-supplier=Element14; ComponentLink2Description: https://datasheet.ciiva.com/8041/1789203-8041529.pdf?src-supplier=Element14; ComponentLink3URL: https://datasheet.ciiva.com/8239/jp028045-8239382.pdf?src-supplier=Avnet; ComponentLink3Description: https://datasheet.ciiva.com/8239/jp028045-8239382.pdf?src-supplier=Avnet; ComponentLink4URL: https://datasheet.ciiva.com/16363/filehandler-aspxddocname-en028045-16363277.pdf?src-supplier=Future+Electronics; ComponentLink4Description: https://datasheet.ciiva.com/16363/filehandler-aspxddocname-en028045-16363277.pdf?src-supplier=Future+Electronics; ComponentLink5URL: https://datasheet.ciiva.com/2051/22001c-2051893.pdf?src-supplier=Digi-Key; ComponentLink5Description: https://datasheet.ciiva.com/2051/22001c-2051893.pdf?src-supplier=Digi-Key; Supplier Part Number 1: MCP1827-3302E/ET-ND
U15 = 74AHC1G14GW,125_INVERTER_SCHMITT_5TSSOP: 74AHC1G14GW/UMT5/REELR//; Manufacturer: NXP Semiconductors; Manufacturer Part Number: 74AHC1G14GW125; RoHS: Yes; Category: Uncategorized; ComponentLink1URL: https://datasheet.ciiva.com/15089/getdatasheetpartid-142249-15089288.pdf?src-supplier=Verical; ComponentLink1Description: https://datasheet.ciiva.com/15089/getdatasheetpartid-142249-15089288.pdf?src-supplier=Verical; ComponentLink2URL: https://datasheet.ciiva.com/25628/0900766b80b49c2c-25628673.pdf?src-supplier=Rs; ComponentLink2Description: https://datasheet.ciiva.com/25628/0900766b80b49c2c-25628673.pdf?src-supplier=Rs; ComponentLink3URL: https://datasheet.ciiva.com/36857/700528-36857863.pdf?src-supplier=Element14; ComponentLink3Description: https://datasheet.ciiva.com/36857/700528-36857863.pdf?src-supplier=Element14; ComponentLink4URL: https://datasheet.ciiva.com/1868/74ahc-ahct1g14-1868109.pdf?src-supplier=Digi-Key; ComponentLink4Description: https://datasheet.ciiva.com/1868/74ahc-ahct1g14-1868109.pdf?src-supplier=Digi-Key; ComponentLink5URL: https://datasheet.ciiva.com/1868/74ahc-ahct1g14-1868108.pdf?src-supplier=Digi-Key; ComponentLink5Description: https://datasheet.ciiva.com/1868/74ahc-ahct1g14-1868108.pdf?src-supplier=Digi-Key; Supplier: Digi-Key; Supplier Part Number: 568-2502-1-ND; ComponentLink6URL: https://datasheet.ciiva.com/1868/74ahc-ahct1g14-1868110.pdf?src-supplier=Digi-Key; ComponentLink6Description: https://datasheet.ciiva.com/1868/74ahc-ahct1g14-1868110.pdf?src-supplier=Digi-Key; ComponentLink7URL: https://datasheet.ciiva.com/8083/74ahc-ahct1g14-8083433.pdf?src-supplier=Avnet; ComponentLink7Description: https://datasheet.ciiva.com/8083/74ahc-ahct1g14-8083433.pdf?src-supplier=Avnet; ComponentLink8URL: https://datasheet.ciiva.com/3305/74ahc-ahct1g14-3305051.pdf?src-supplier=Avnet; ComponentLink8Description: https://datasheet.ciiva.com/3305/74ahc-ahct1g14-3305051.pdf?src-supplier=Avnet; ComponentLink9URL: https://datasheet.ciiva.com/22780/700528-22780172.pdf?src-supplier=Farnell; ComponentLink9Description: https://datasheet.ciiva.com/22780/700528-22780172.pdf?src-supplier=Farnell; ComponentLink10URL: https://datasheet.ciiva.com/33739/700528-33739445.pdf?src-supplier=Farnell; ComponentLink10Description: https://datasheet.ciiva.com/33739/700528-33739445.pdf?src-supplier=Farnell